# Altium schematic sheet PY32F002BF1xP_START.SchDoc: =DocumentName
size A3; Revision: V2.0; SheetNumber: 2; SheetTotal: 2
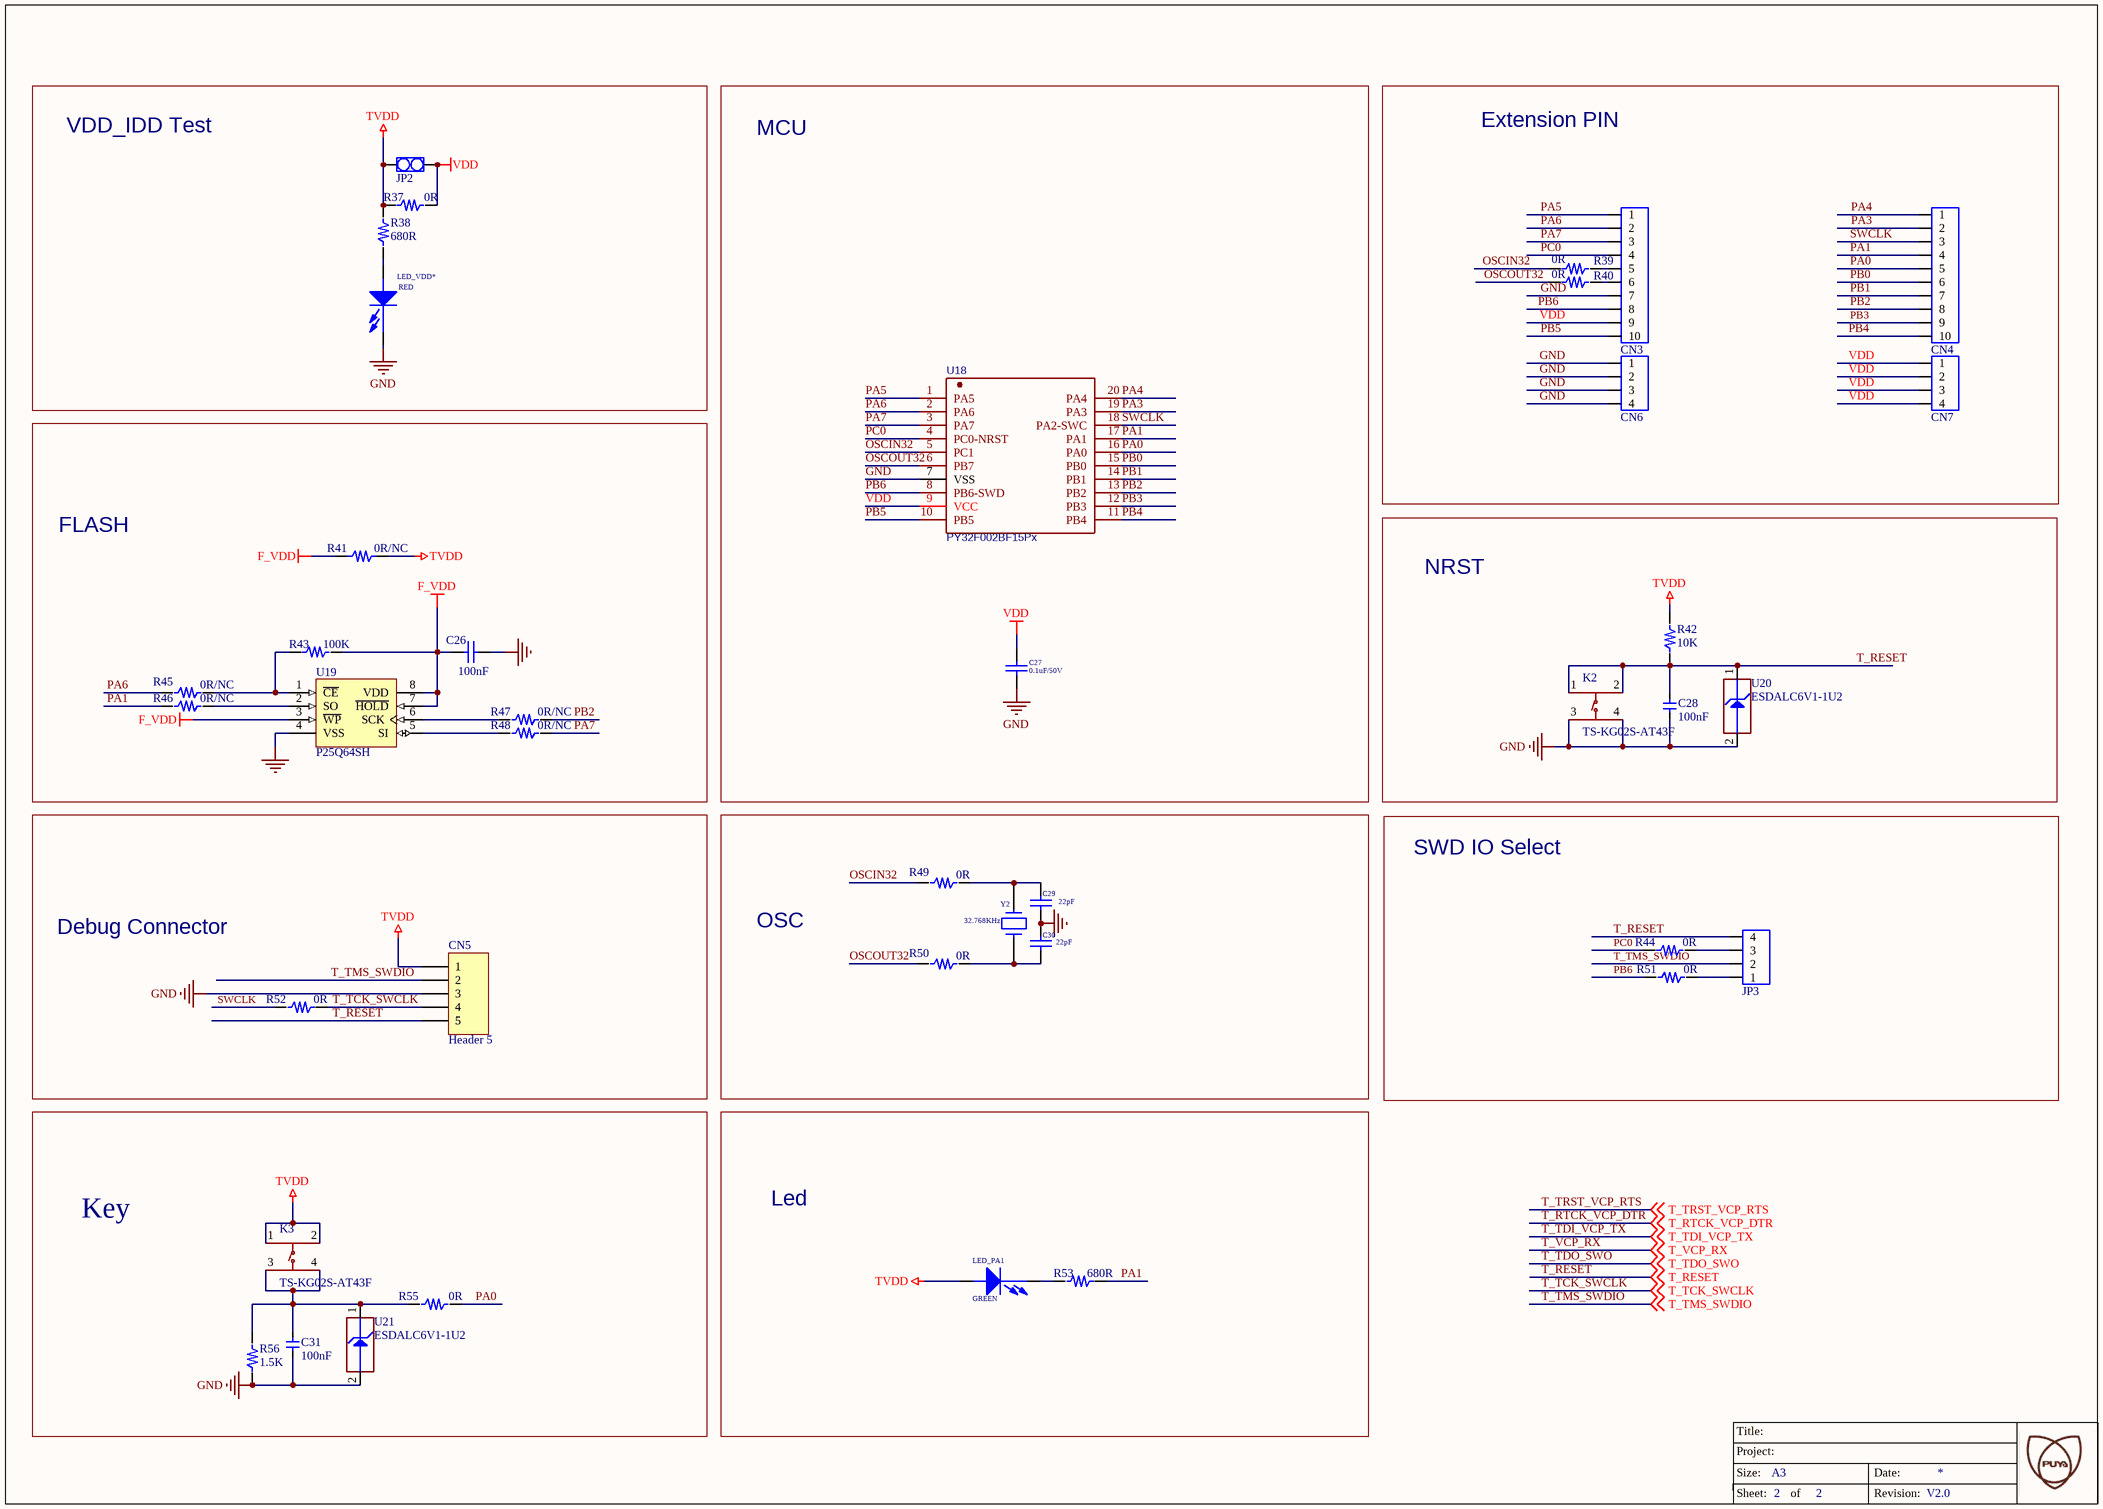
[diagram p0: PY32F002BF1xP_START.SchDoc]

## Parts
C26  100nF  [C0603]
C27  0.1uF/50V  [0603C]
C28  100nF  [C0603]
C29  22pF  [0603C]
C30  22pF  [0603C]
C31  100nF  [C0603]
CN3  CON10  [CON10]  (value not drawn)
CN4  CON10  [CON10]  (value not drawn)
CN5  Header 5  [HDR1X5]
CN6  CON4  [CON4]  (value not drawn)
CN7  CON4  [CON4]  (value not drawn)
JP2  CON2  [CON2]  (value not drawn)
JP3  CON4  [CON4]  (value not drawn)
K2  TS-KG02S-AT43F  [SW-SMD_4P-L6.0-W6.0-P4.50-LS8.5]
K3  TS-KG02S-AT43F  [SW-SMD_4P-L6.0-W6.0-P4.50-LS8.5]
LED_PA1  GREEN  [0603_LED]
LED_VDD*  RED  [0603_LED]
R37  0R  [JP2_SMD]
R38  680R  [R0603]
R39  0R  [JP2_SMD]
R40  0R  [JP2_SMD]
R41  0R/NC  [JP2_SMD]
R42  10K  [R0603]
R43  100K  [R0603]
R44  0R  [JP2_SMD]
R45  0R/NC  [JP2_SMD]
R46  0R/NC  [JP2_SMD]
R47  0R/NC  [JP2_SMD]
R48  0R/NC  [JP2_SMD]
R49  0R  [JP2_SMD]
R50  0R  [JP2_SMD]
R51  0R  [JP2_SMD]
R52  0R  [JP2_SMD]
R53  680R  [R0603]
R55  0R  [JP2_SMD]
R56  1.5K  [R0603]
U18  PY32F002BF15Px  [TSSOP-20_L6.5-W4.4-P0.65-LS6.4-BL]
U19  P25Q64SH  [SOP-8P]
U20  ESDALC6V1-1U2  [ESD_ST0201]
U21  ESDALC6V1-1U2  [ESD_ST0201]
Y2  32.768KHz  [CRYSTAL-SMD_L3.2-W1.5-1]

## Blocks framed on the sheet
VDD_IDD Test: JP2 LED_VDD* R37 R38
MCU: C27 U18
Extension PIN: CN3 CN4 CN6 CN7 R39 R40
FLASH: C26 R41 R43 R45-R48 U19
NRST: C28 K2 R42 U20
Debug Connector: CN5 R52
OSC: C29 C30 R49 R50 Y2
SWD IO Select: JP3 R44 R51
Key: C31 K3 R55 R56 U21
Led: LED_PA1 R53

## Nets
F_VDD: C26.2 R41.2 R43.2 U19.3(~{WP}) U19.7(~{HOLD}) U19.8(VDD)
GND: C26.1 C27.1 C28.1 C29.1 C30.2 C31.1 CN3.7 CN5.3 CN6.1 CN6.2 CN6.3 CN6.4 K2.3 K2.4 LED_VDD*.2(CATHODE) R56.1 U18.7(VSS) U19.4(VSS) U20.2(GND) U21.2(GND)
TVDD: CN5.1 JP2.1 K3.1 K3.2 LED_PA1.1(ANODE) R37.1 R38.2 R41.1 R42.1
VDD: C27.2 CN3.9 CN7.1 CN7.2 CN7.3 CN7.4 JP2.2 R37.2 U18.9(VCC)
OSCIN32: R39.1 R49.2 U18.5(PC1)
OSCOUT32: R40.1 R50.2 U18.6(PB7)
PA0: CN4.5 R55.2 U18.16(PA0)
PA1: CN4.4 R46.2 R53.2 U18.17(PA1)
PA3: CN4.2 U18.19(PA3)
PA4: CN4.1 U18.20(PA4)
PA5: CN3.1 U18.1(PA5)
PA6: CN3.2 R45.2 U18.2(PA6)
PA7: CN3.3 R48.1 U18.3(PA7)
PB0: CN4.6 U18.15(PB0)
PB1: CN4.7 U18.14(PB1)
PB2: CN4.8 R47.1 U18.13(PB2)
PB3: CN4.9 U18.12(PB3)
PB4: CN4.10 U18.11(PB4)
PB5: CN3.10 U18.10(PB5)
PB6: CN3.8 R51.2 U18.8(PB6-SWD)
PC0: CN3.4 R44.2 U18.4(PC0-NRST)
SWCLK: CN4.3 R52.2 U18.18(PA2-SWC)
T_RESET: C28.2 CN5.5 JP3.4 K2.1 K2.2 R42.2 U20.1(IO1) ; off-sheet T_RESET
T_TCK_SWCLK: CN5.4 R52.1 ; off-sheet T_TCK_SWCLK
T_TMS_SWDIO: CN5.2 JP3.2 ; off-sheet T_TMS_SWDIO
NetC29_2: C29.2 R49.1 Y2.1
NetC30_1: C30.1 R50.1 Y2.2
NetC31_2: C31.2 K3.3 K3.4 R55.1 R56.2 U21.1(IO1)
NetCN3_5: CN3.5 R39.2
NetCN3_6: CN3.6 R40.2
NetJP3_1: JP3.1 R51.1
NetJP3_3: JP3.3 R44.1
NetLED_PA1_2: LED_PA1.2(CATHODE) R53.1
NetLED_VDD*_1: LED_VDD*.1(ANODE) R38.1
NetR43_1: R43.1 R45.1 U19.1(~{CE})
NetR46_1: R46.1 U19.2(SO)
NetR47_2: R47.2 U19.6(SCK)
NetR48_2: R48.2 U19.5(SI)

## Notes on the sheet
- Title:
- Project:
- Size:
- Sheet:
- A3
- of
- Date:
- Revision:

## Library data of the parts
C26 = 贴片高压陶瓷电容: Capacitor (Semiconductor SIM Model); 器件封装(外观): 0603; Value: 104
C27 = CAP: Capacitor; Value: 2.2uF; Published: 8-Jun-2000; Publisher: Altium Limited; LatestRevisionDate: 17-Jul-2002; LatestRevisionNote: Re-released for DXP Platform.; PackageReference: RAD-0.3
C28 C31 = C0603: PCB DECAL: 0603
C29 C30 = Cap: Capacitor; Published: 8-Jun-2000; Revision: July-2002: Re-released for DXP Platform.; Publisher: Altium Limited; Value: 22pF
CN5 = Header 5: Header, 5-Pin; LatestRevisionDate: 17-Jul-2002; LatestRevisionNote: Re-released for DXP Platform.; Publisher: Altium Limited
JP2 = CON2_DIP
K2 K3 = TS-KG02S-AT43F: Manufacturer: HANBO(汉博); Add into BOM: yes; Circuit: 单刀单掷; Actuator Style: 圆形按钮; Operating Force: 250gf; Switch Length: 6mm; Switch Height: 4.3mm; Strike Gundam: 不带; Contact Current: 50mA; Voltage Rating (DC): 12V; Insulation Resistance: 100MΩ; Actuator/Cap Color: 黑色; Pin Style: 鸥翼型; Symbol: TS-KG02S-AT43F; Device: TS-KG02S-AT43F; LCSC Part Name: 6*6*4.3mm 立贴 轻触开关; Supplier Part: C2874283; Manufacturer Part: TS-KG02S-AT43F; Supplier Footprint: SMD; JLCPCB Part Class: 扩展库; Datasheet: https://atta.szlcsc.com/upload/public/pdf/source/20221110/4B16732C66B2A039D9853E84B21A4EEA.pdf; Supplier: LCSC; Convert to PCB: yes; Mounting Style: 立贴; Switch Width: 6mm; Mechanical Life: -
LED_PA1 LED_VDD* = PDI-E803_Dup1
R37-R53 R55 R56 = R0603: PCB DECAL: 0603
U18 = PY32F002BF15Px: TSSOP20; BOM_Manufacturer: PUYA(普冉); BOM_Manufacturer Part: PY32F002BF15Px; spicePre: U; spiceSymbolName: PY32F002BF15Px
U19 = SST25VF010: Value: SST25VF020B; 器件封装(外观): SOP8
U20 U21 = ESDALC6V1-1U2: ESD protection 6V1; Internal_Part_Number: MCD-00170; Part_Type: Diode; Manufacturer: STMICROELECTRONICS; ECCN_US: EAR99; ECCN_EU: NEC; Provided_By: Subcon; Initial_Board_Reference: MB1274; Status: Released; Manufacturer_Part_Number: ESDALC6V1-1U2; ComponentLink1Description: STM_ESD_ESDALC6V1-1U2.pdf; ComponentLink1URL: http://tunmcdsvn.tun.st.com/Component_Datasheet_Library/Trunk/Diodes/STM_ESD_ESDALC6V1-1U2; Value: ESDALC6V1-1U2
Y2 = CRYSTAL_1: Crystal; Value: X503225MSB2GI